# EAGLE design ME433-2021 (EAGLE 9.6.2)
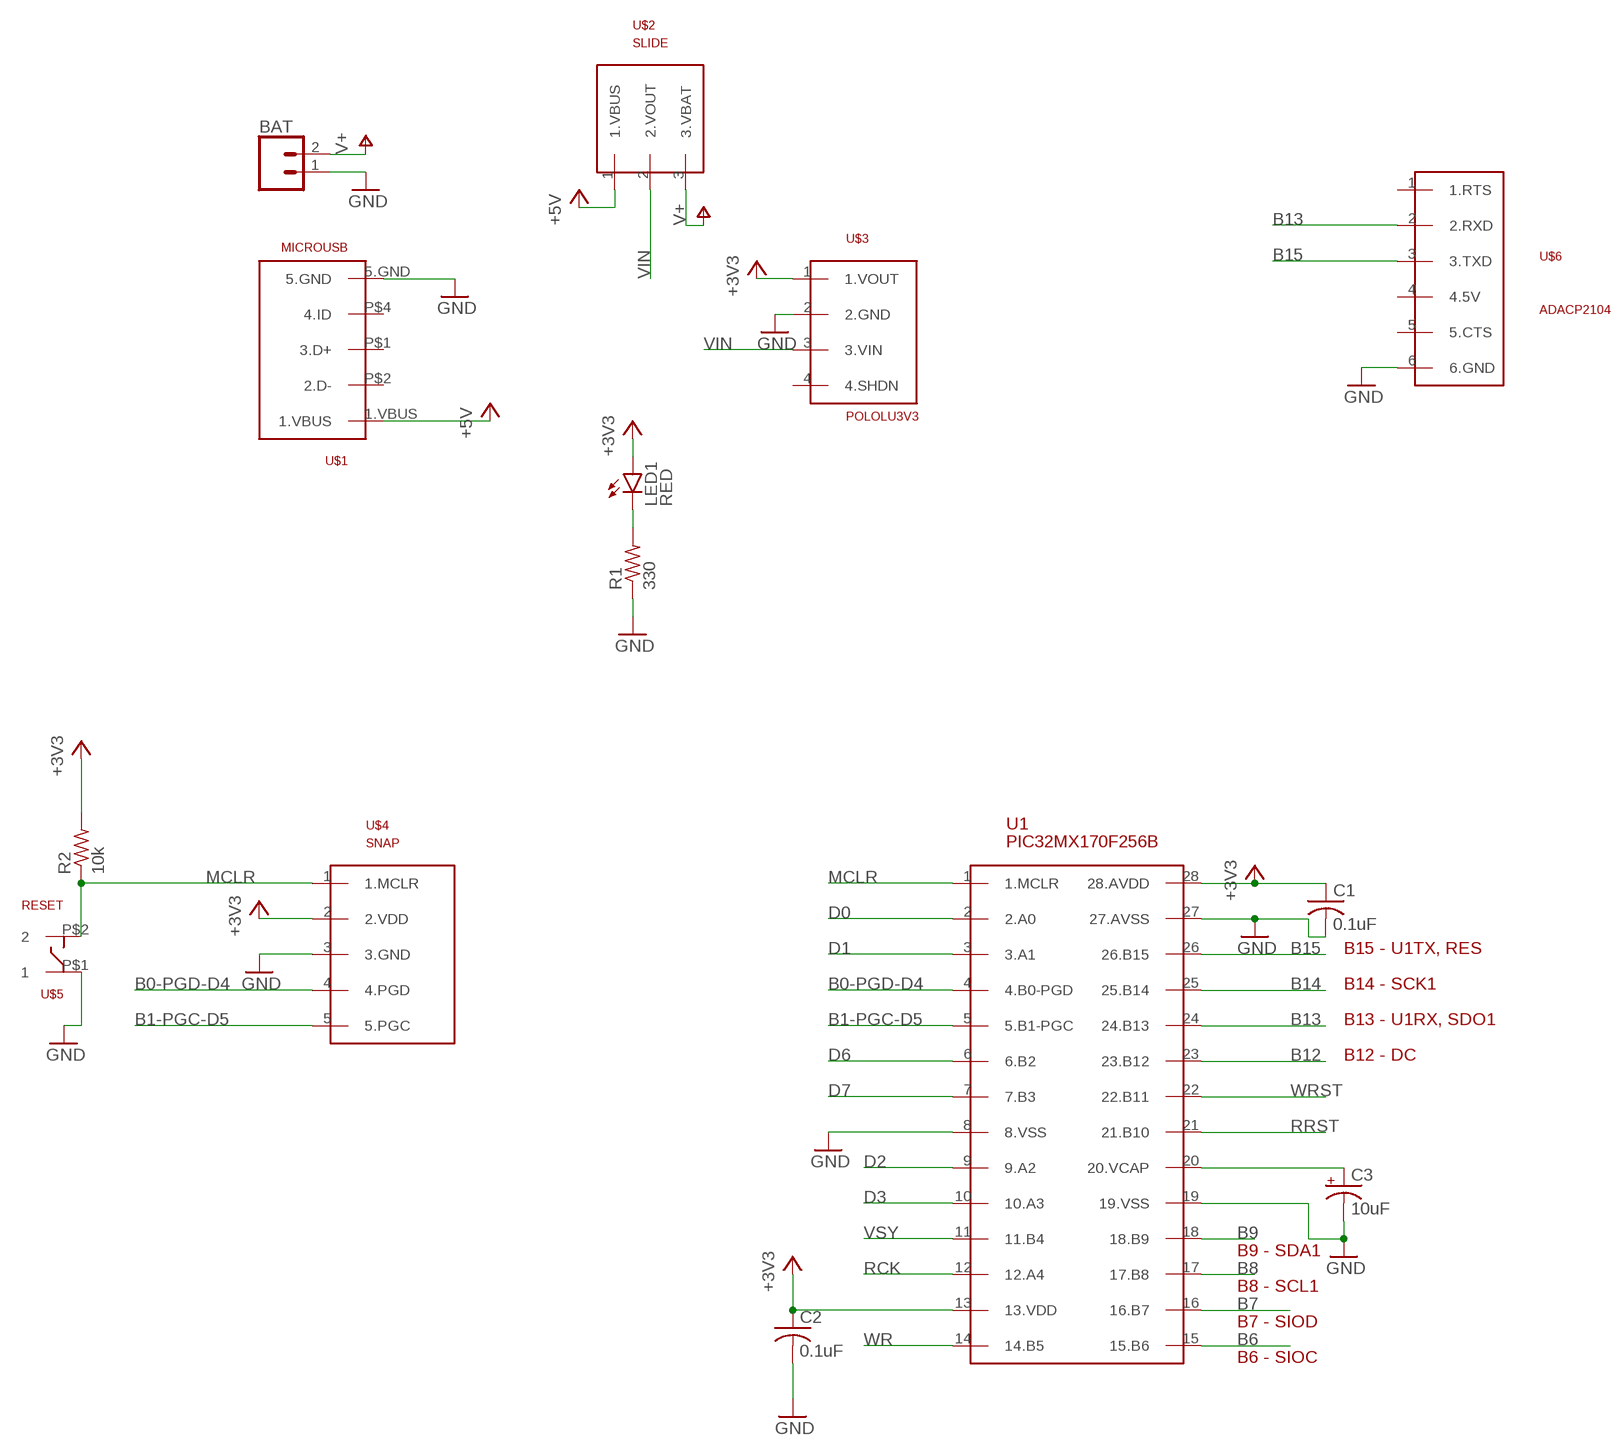
[diagram p0: schematic, sheet 1, part 1 of 2]
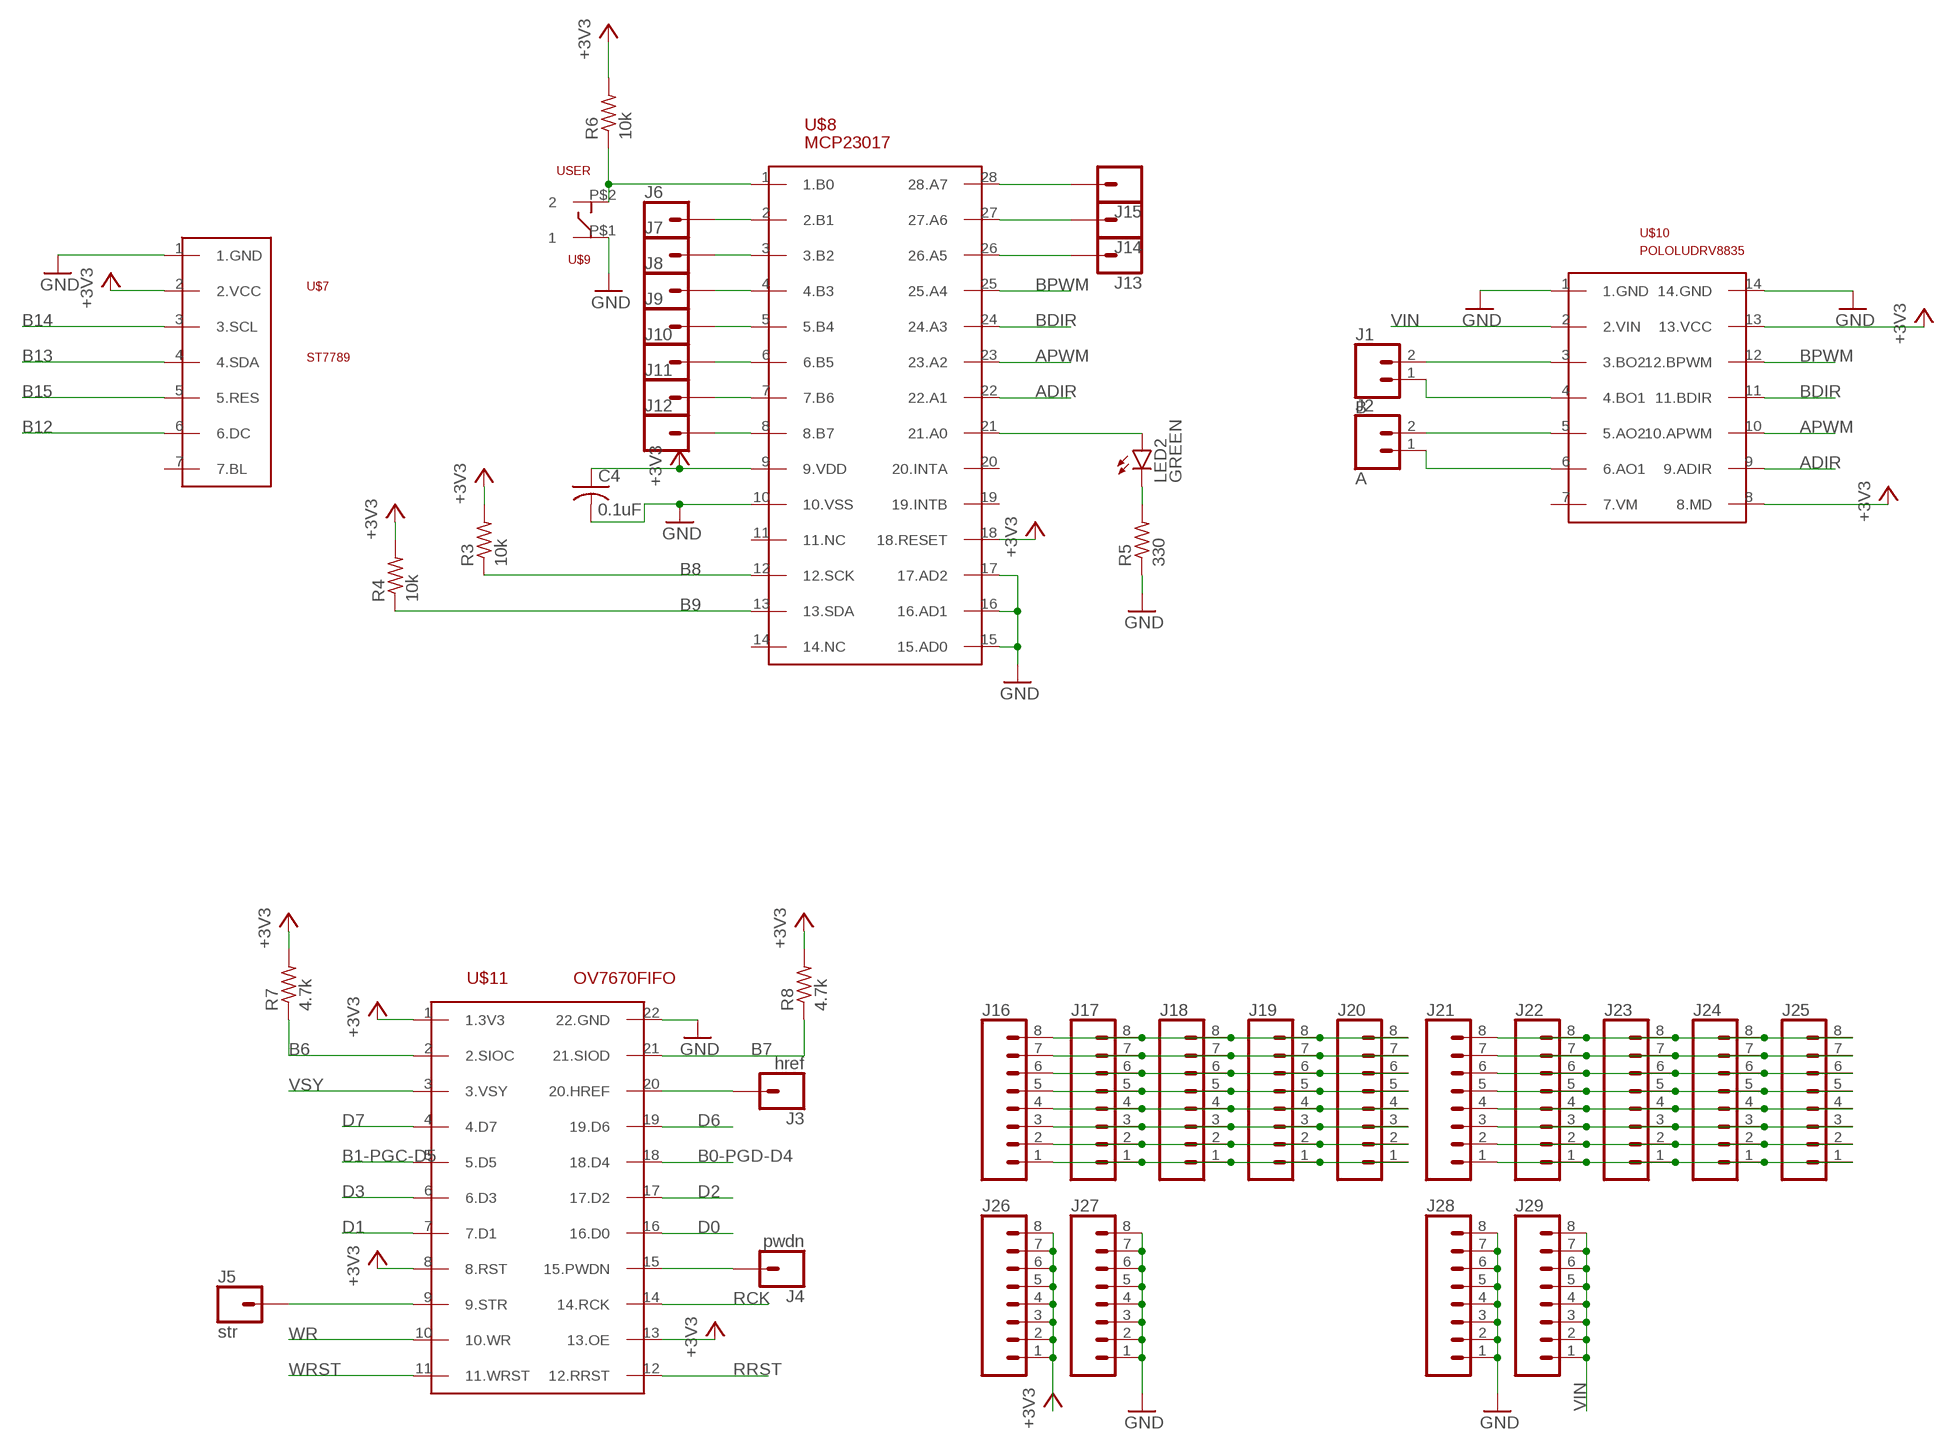
[diagram p1: schematic, sheet 1, part 2 of 2]

## Parts
BAT  CONN_02  [1X02]
C1  0.1uF  C-US025-030X050  [C025-030X050]
C2  0.1uF  C-US025-030X050  [C025-030X050]
C3  10uF  CPOL-USB45181B  [B45181B]
C4  0.1uF  C-US025-030X050  [C025-030X050]
J1  B  CONN_02  [1X02]
J2  A  CONN_02  [1X02]
J3  href  CONN_01  [1X01]
J4  pwdn  CONN_01  [1X01]
J5  str  CONN_01  [1X01]
J6  CONN_01  [1X01]
J7  CONN_01  [1X01]
J8  CONN_01  [1X01]
J9  CONN_01  [1X01]
J10  CONN_01  [1X01]
J11  CONN_01  [1X01]
J12  CONN_01  [1X01]
J13  CONN_01  [1X01]
J14  CONN_01  [1X01]
J15  CONN_01  [1X01]
J16  CONN_08"  [1X08]
J17  CONN_08"  [1X08]
J18  CONN_08"  [1X08]
J19  CONN_08"  [1X08]
J20  CONN_08"  [1X08]
J21  CONN_08"  [1X08]
J22  CONN_08"  [1X08]
J23  CONN_08"  [1X08]
J24  CONN_08"  [1X08]
J25  CONN_08"  [1X08]
J26  CONN_08"  [1X08]
J27  CONN_08"  [1X08]
J28  CONN_08"  [1X08]
J29  CONN_08"  [1X08]
LED1  RED  LED3MM  [LED3MM]
LED2  GREEN  LED3MM  [LED3MM]
R1  330  R-US_0207/10  [0207/10]
R2  10k  R-US_0207/10  [0207/10]
R3  10k  R-US_0207/10  [0207/10]
R4  10k  R-US_0207/10  [0207/10]
R5  330  R-US_0207/10  [0207/10]
R6  10k  R-US_0207/10  [0207/10]
R7  4.7k  R-US_0207/10  [0207/10]
R8  4.7k  R-US_0207/10  [0207/10]
U1  PIC32MX170F256B  [DIL28-3]
U$1  MICROUSB  [MICROUSB]
U$2  SLIDE  [SLIDE]
U$3  POLOLU3V3  [POLOLU3V3]
U$4  SNAP  [SNAP]
U$5  RESET  PUSH  [PUSH]
U$6  ADACP2104  [ADACP2104]
U$7  ST7789  [ST7789]
U$8  MCP23017  [DIL28-3]
U$9  USER  PUSH  [PUSH]
U$10  POLOLUDRV8835  [POLOLUDRV8835]
U$11  OV7670FIFO  [OV7670FIFO]

## Nets
+3V3: C1.1 C2.1 C4.1 J26.1 J26.2 J26.3 J26.4 J26.5 J26.6 J26.7 J26.8 LED1.A R2.2 R3.2 R4.2 R6.2 R7.2 R8.2 U1.13(13.VDD) U1.28(28.AVDD) U$3.1(1.VOUT) U$4.2(2.VDD) U$7.2(2.VCC) U$8.9(9.VDD) U$8.18(18.RESET) U$10.8(8.MD) U$10.13(13.VCC) U$11.1(1.3V3) U$11.8(8.RST) U$11.13(13.OE)
+5V: U$1.1.VBUS U$2.1(1.VBUS)
ADIR: U$8.22(22.A1) U$10.9(9.ADIR)
APWM: U$8.23(23.A2) U$10.10(10.APWM)
B0-PGD-D4: U1.4(4.B0-PGD) U$4.4(4.PGD) U$11.18(18.D4)
B1-PGC-D5: U1.5(5.B1-PGC) U$4.5(5.PGC) U$11.5(5.D5)
B6: R7.1 U1.15(15.B6) U$11.2(2.SIOC)
B7: R8.1 U1.16(16.B7) U$11.21(21.SIOD)
B8: R3.1 U1.17(17.B8) U$8.12(12.SCK)
B9: R4.1 U1.18(18.B9) U$8.13(13.SDA)
B12: U1.23(23.B12) U$7.6(6.DC)
B13: U1.24(24.B13) U$6.2(2.RXD) U$7.4(4.SDA)
B14: U1.25(25.B14) U$7.3(3.SCL)
B15: U1.26(26.B15) U$6.3(3.TXD) U$7.5(5.RES)
BDIR: U$8.24(24.A3) U$10.11(11.BDIR)
BPWM: U$8.25(25.A4) U$10.12(12.BPWM)
D0: U1.2(2.A0) U$11.16(16.D0)
D1: U1.3(3.A1) U$11.7(7.D1)
D2: U1.9(9.A2) U$11.17(17.D2)
D3: U1.10(10.A3) U$11.6(6.D3)
D6: U1.6(6.B2) U$11.19(19.D6)
D7: U1.7(7.B3) U$11.4(4.D7)
GND: BAT.1 C1.2 C2.2 C3.- C4.2 J27.1 J27.2 J27.3 J27.4 J27.5 J27.6 J27.7 J27.8 J28.1 J28.2 J28.3 J28.4 J28.5 J28.6 J28.7 J28.8 R1.1 R5.1 U1.8(8.VSS) U1.19(19.VSS) U1.27(27.AVSS) U$1.5.GND U$3.2(2.GND) U$4.3(3.GND) U$5.P$1 U$6.6(6.GND) U$7.1(1.GND) U$8.10(10.VSS) U$8.15(15.AD0) U$8.16(16.AD1) U$8.17(17.AD2) U$9.P$1 U$10.1(1.GND) U$10.14(14.GND) U$11.22(22.GND)
MCLR: R2.1 U1.1(1.MCLR) U$4.1(1.MCLR) U$5.P$2
N$1: LED1.K(C) R1.2
N$2: LED2.A U$8.21(21.A0)
N$3: C3.+ U1.20(20.VCAP)
N$4: R6.1 U$8.1(1.B0) U$9.P$2
N$5: LED2.K(C) R5.2
N$6: J1.2 U$10.3(3.BO2)
N$7: J1.1 U$10.4(4.BO1)
N$8: J2.2 U$10.5(5.AO2)
N$9: J2.1 U$10.6(6.AO1)
N$10: J3.1 U$11.20(20.HREF)
N$11: J4.1 U$11.15(15.PWDN)
N$12: J5.1 U$11.9(9.STR)
N$13: J15.1 U$8.28(28.A7)
N$14: J14.1 U$8.27(27.A6)
N$15: J13.1 U$8.26(26.A5)
N$16: J6.1 U$8.2(2.B1)
N$17: J7.1 U$8.3(3.B2)
N$18: J8.1 U$8.4(4.B3)
N$19: J9.1 U$8.5(5.B4)
N$20: J10.1 U$8.6(6.B5)
N$21: J11.1 U$8.7(7.B6)
N$22: J12.1 U$8.8(8.B7)
N$23: J16.8 J17.8 J18.8 J19.8 J20.8
N$24: J16.7 J17.7 J18.7 J19.7 J20.7
N$25: J16.6 J17.6 J18.6 J19.6 J20.6
N$26: J16.5 J17.5 J18.5 J19.5 J20.5
N$27: J16.4 J17.4 J18.4 J19.4 J20.4
N$28: J16.3 J17.3 J18.3 J19.3 J20.3
N$29: J16.2 J17.2 J18.2 J19.2 J20.2
N$30: J16.1 J17.1 J18.1 J19.1 J20.1
N$31: J21.8 J22.8 J23.8 J24.8 J25.8
N$32: J21.7 J22.7 J23.7 J24.7 J25.7
N$33: J21.6 J22.6 J23.6 J24.6 J25.6
N$34: J21.5 J22.5 J23.5 J24.5 J25.5
N$35: J21.4 J22.4 J23.4 J24.4 J25.4
N$36: J21.3 J22.3 J23.3 J24.3 J25.3
N$37: J21.2 J22.2 J23.2 J24.2 J25.2
N$38: J21.1 J22.1 J23.1 J24.1 J25.1
RCK: U1.12(12.A4) U$11.14(14.RCK)
RRST: U1.21(21.B10) U$11.12(12.RRST)
V+: BAT.2 U$2.3(3.VBAT)
VIN: J29.1 J29.2 J29.3 J29.4 J29.5 J29.6 J29.7 J29.8 U$2.2(2.VOUT) U$3.3(3.VIN) U$10.2(2.VIN)
VSY: U1.11(11.B4) U$11.3(3.VSY)
WR: U1.14(14.B5) U$11.10(10.WR)
WRST: U1.22(22.B11) U$11.11(11.WRST)
Unconnected: U$1.P$1(3.D+) U$1.P$2(2.D-) U$1.P$4(4.ID) U$3.4(4.SHDN) U$6.1(1.RTS) U$6.4(4.5V) U$6.5(5.CTS) U$7.7(7.BL) U$8.11(11.NC) U$8.14(14.NC) U$8.19(19.INTB) U$8.20(20.INTA) U$10.7(7.VM)

## Notes on the sheet
- B15 - U1TX, RES
- B14 - SCK1
- B13 - U1RX, SDO1
- B12 - DC
- B9 - SDA1
- B8 - SCL1
- B7 - SIOD
- B6 - SIOC

## Library data of the parts
BAT J1 J2 = me433-2021:CONN_02: Multi connection point. Often used as Generic Header-pin footprint for 0.1 inch spaced/style header connections On any of the 0.1 inch spaced packages, you can populate with these: Break Away Headers - Straight <https://www.sparkfun.com/products/116> (PRT-00116) Break Away Male Headers - Right Angle <https://www.sparkfun.com/products/553> (PRT-00553) Female Headers <https://www.sparkfun.com/products/115> (PRT-00115) Break Away Headers - Machine Pin <https://www.sparkfun.com/products/117> (PRT-00117) Break Away Female Headers - Swiss Machine Pin <https://www.sparkfun.com/products/743> (PRT-00743) For SCREWTERMINALS and SPRING TERMINALS visit here: Screw Terimnals on SparkFun.com <https://www.sparkfun.com/search/results?term=Screw+Terminals> (5mm/3.5mm/2.54mm spacing) This device is also useful as a general connection point to wire up your design to another part of your project. Our various solder wires solder well into these plated through hole pads. Hook-Up Wire - Assortment (Stranded, 22 AWG) <https://www.sparkfun.com/products/11375> (PRT-11375) Hook-Up Wire - Assortment (Solid Core, 22 AWG) <https://www.sparkfun.com/products/11367> (PRT-11367) View the entire wire category on our website here <https://www.sparkfun.com/categories/141> Special notes: Molex polarized connector foot print use with: PRT-08233 with associated crimp pins and housings. 2.54_SCREWTERM for use with PRT-10571. 3.5mm Screw Terminal footprints for PRT-08084 5mm Screw Terminal footprints for use with PRT-08432
C1 C2 C4 = me433-2021:C-US: CAPACITOR, American symbol; SPICEPREFIX: C
C3 = me433-2021:CPOL-US: POLARIZED CAPACITOR, American symbol; SPICEPREFIX: C
J3-J15 = me433-2021:CONN_01: Single connection point. Often used as Generic Header-pin footprint for 0.1 inch spaced/style header connections On any of the 0.1 inch spaced packages, you can populate with these: Break Away Headers - Straight <https://www.sparkfun.com/products/116> (PRT-00116) Break Away Male Headers - Right Angle <https://www.sparkfun.com/products/553> (PRT-00553) Female Headers <https://www.sparkfun.com/products/115> (PRT-00115) Break Away Headers - Machine Pin <https://www.sparkfun.com/products/117> (PRT-00117) Break Away Female Headers - Swiss Machine Pin <https://www.sparkfun.com/products/743> (PRT-00743) This device is also useful as a general connection point to wire up your design to another part of your project. Our various solder wires solder well into these plated through hole pads. Hook-Up Wire - Assortment (Stranded, 22 AWG) <https://www.sparkfun.com/products/11375> (PRT-11375) Hook-Up Wire - Assortment (Solid Core, 22 AWG) <https://www.sparkfun.com/products/11367> (PRT-11367) View the entire wire category on our website here <https://www.sparkfun.com/categories/141> Special notes: SMTSO-256-ET is a "flush mount" nut for a 4-40 screw. We mostly use this on specialty testbeds; it is a nice way to connect hardware to your PCB at an adjustable hieght. Also note, the SNAP packages are for using a snappable style connector. We sell a baggie of snaps and they are also used on two LilyPad designs: Snap Assortment - 30 pack (male and female) <https://www.sparkfun.com/products/11347> (DEV-11347) LilyPad Arduino SimpleSnap <https://www.sparkfun.com/products/10941> (DEV-10941) LilyPad SimpleSnap Protoboard <https://www.sparkfun.com/products/10940> (DEV-10940)
J16-J29 = me433-2021:CONN_08: Multi connection point. Often used as Generic Header-pin footprint for 0.1 inch spaced/style header connections On any of the 0.1 inch spaced packages, you can populate with these: Break Away Headers - Straight <https://www.sparkfun.com/products/116> (PRT-00116) Break Away Male Headers - Right Angle <https://www.sparkfun.com/products/553> (PRT-00553) Female Headers <https://www.sparkfun.com/products/115> (PRT-00115) Break Away Headers - Machine Pin <https://www.sparkfun.com/products/117> (PRT-00117) Break Away Female Headers - Swiss Machine Pin <https://www.sparkfun.com/products/743> (PRT-00743) Arduino Stackable Header - 8 Pin <https://www.sparkfun.com/products/9279> (PRT-09279) For SCREWTERMINALS and SPRING TERMINALS visit here: Screw Terimnals on SparkFun.com <https://www.sparkfun.com/search/results?term=Screw+Terminals> (5mm/3.5mm/2.54mm spacing) This device is also useful as a general connection point to wire up your design to another part of your project. Our various solder wires solder well into these plated through hole pads. Hook-Up Wire - Assortment (Stranded, 22 AWG) <https://www.sparkfun.com/products/11375> (PRT-11375) Hook-Up Wire - Assortment (Solid Core, 22 AWG) <https://www.sparkfun.com/products/11367> (PRT-11367) View the entire wire category on our website here <https://www.sparkfun.com/categories/141> Special notes: Molex polarized connector foot print use with SKU : PRT-08231 with associated crimp pins and housings. 1MM SMD Version SKU: PRT-10208 NOTES ON THE VARIANTS LOCK and LOCK_LONGPADS... This footprint was designed to help hold the alignment of a through-hole component (i.e. 6-pin header) while soldering it into place. You may notice that each hole has been shifted either up or down by 0.005 of an inch from it's more standard position (which is a perfectly straight line). This slight alteration caused the pins (the squares in the middle) to touch the edges of the holes. Because they are alternating, it causes a "brace" to hold the component in place. 0.005 has proven to be the perfect amount of "off-center" position when using our standard breakaway headers. Although looks a little odd when you look at the bare footprint, once you have a header in there, the alteration is very hard to notice. Also,if you push a header all the way into place, it is covered up entirely on the bottom side.; PROD_ID: CONN-08438
LED1 LED2 = me433-2021:LED: LED OSRAM: - CHIPLED LG R971, LG N971, LY N971, LG Q971, LY Q971, LO R971, LY R971 LH N974, LH R974 LS Q976, LO Q976, LY Q976 LO Q996 - Hyper CHIPLED LW Q18S LB Q993, LB Q99A, LB R99A - SideLED LS A670, LO A670, LY A670, LG A670, LP A670 LB A673, LV A673, LT A673, LW A673 LH A674 LY A675 LS A676, LA A676, LO A676, LY A676, LW A676 LS A679, LY A679, LG A679 - Hyper Micro SIDELED® LS Y876, LA Y876, LO Y876, LY Y876 LT Y87S - SmartLED LW L88C, LW L88S LB L89C, LB L89S, LG L890 LS L89K, LO L89K, LY L89K LS L896, LA L896, LO L896, LY L896 - TOPLED LS T670, LO T670, LY T670, LG T670, LP T670 LSG T670, LSP T670, LSY T670, LOP T670, LYG T670 LG T671, LOG T671, LSG T671 LB T673, LV T673, LT T673, LW T673 LH T674 LS T676, LA T676, LO T676, LY T676, LB T676, LH T676, LSB T676, LW T676 LB T67C, LV T67C, LT T67C, LS T67K, LO T67K, LY T67K, LW E67C LS E67B, LA E67B, LO E67B, LY E67B, LB E67C, LV E67C, LT E67C LW T67C LS T679, LY T679, LG T679 LS T770, LO T770, LY T770, LG T770, LP T770 LB T773, LV T773, LT T773, LW T773 LH T774 LS E675, LA E675, LY E675, LS T675 LS T776, LA T776, LO T776, LY T776, LB T776 LHGB T686 LT T68C, LB T68C - Hyper Mini TOPLED® LB M676 - Mini TOPLED Santana® LG M470 LS M47K, LO M47K, LY M47K Source: http://www.osram.convergy.de LUXEON: - LUMILED® LXK2-PW12-R00, LXK2-PW12-S00, LXK2-PW14-U00, LXK2-PW14-V00 LXK2-PM12-R00, LXK2-PM12-S00, LXK2-PM14-U00 LXK2-PE12-Q00, LXK2-PE12-R00, LXK2-PE12-S00, LXK2-PE14-T00, LXK2-PE14-U00 LXK2-PB12-K00, LXK2-PB12-L00, LXK2-PB12-M00, LXK2-PB14-N00, LXK2-PB14-P00, LXK2-PB14-Q00 LXK2-PR12-L00, LXK2-PR12-M00, LXK2-PR14-Q00, LXK2-PR14-R00 LXK2-PD12-Q00, LXK2-PD12-R00, LXK2-PD12-S00 LXK2-PH12-R00, LXK2-PH12-S00 LXK2-PL12-P00, LXK2-PL12-Q00, LXK2-PL12-R00 Source: www.luxeon.com KINGBRIGHT: KA-3528ASYC Source: www.kingbright.com
R1-R8 = me433-2021:R-US_: RESISTOR, American symbol; SPICEPREFIX: R
U1 = me433-2021:PIC32MX170F256B
U$1 = me433-2021:MICROUSB
U$2 = me433-2021:SLIDE
U$3 = me433-2021:POLOLU3V3
U$4 = me433-2021:SNAP
U$5 U$9 = me433-2021:PUSH
U$6 = me433-2021:ADACP2104
U$7 = me433-2021:ST7789
U$8 = me433-2021:MCP23017
U$10 = me433-2021:POLOLUDRV8835
U$11 = me433-2021:OV7670FIFO

## Board
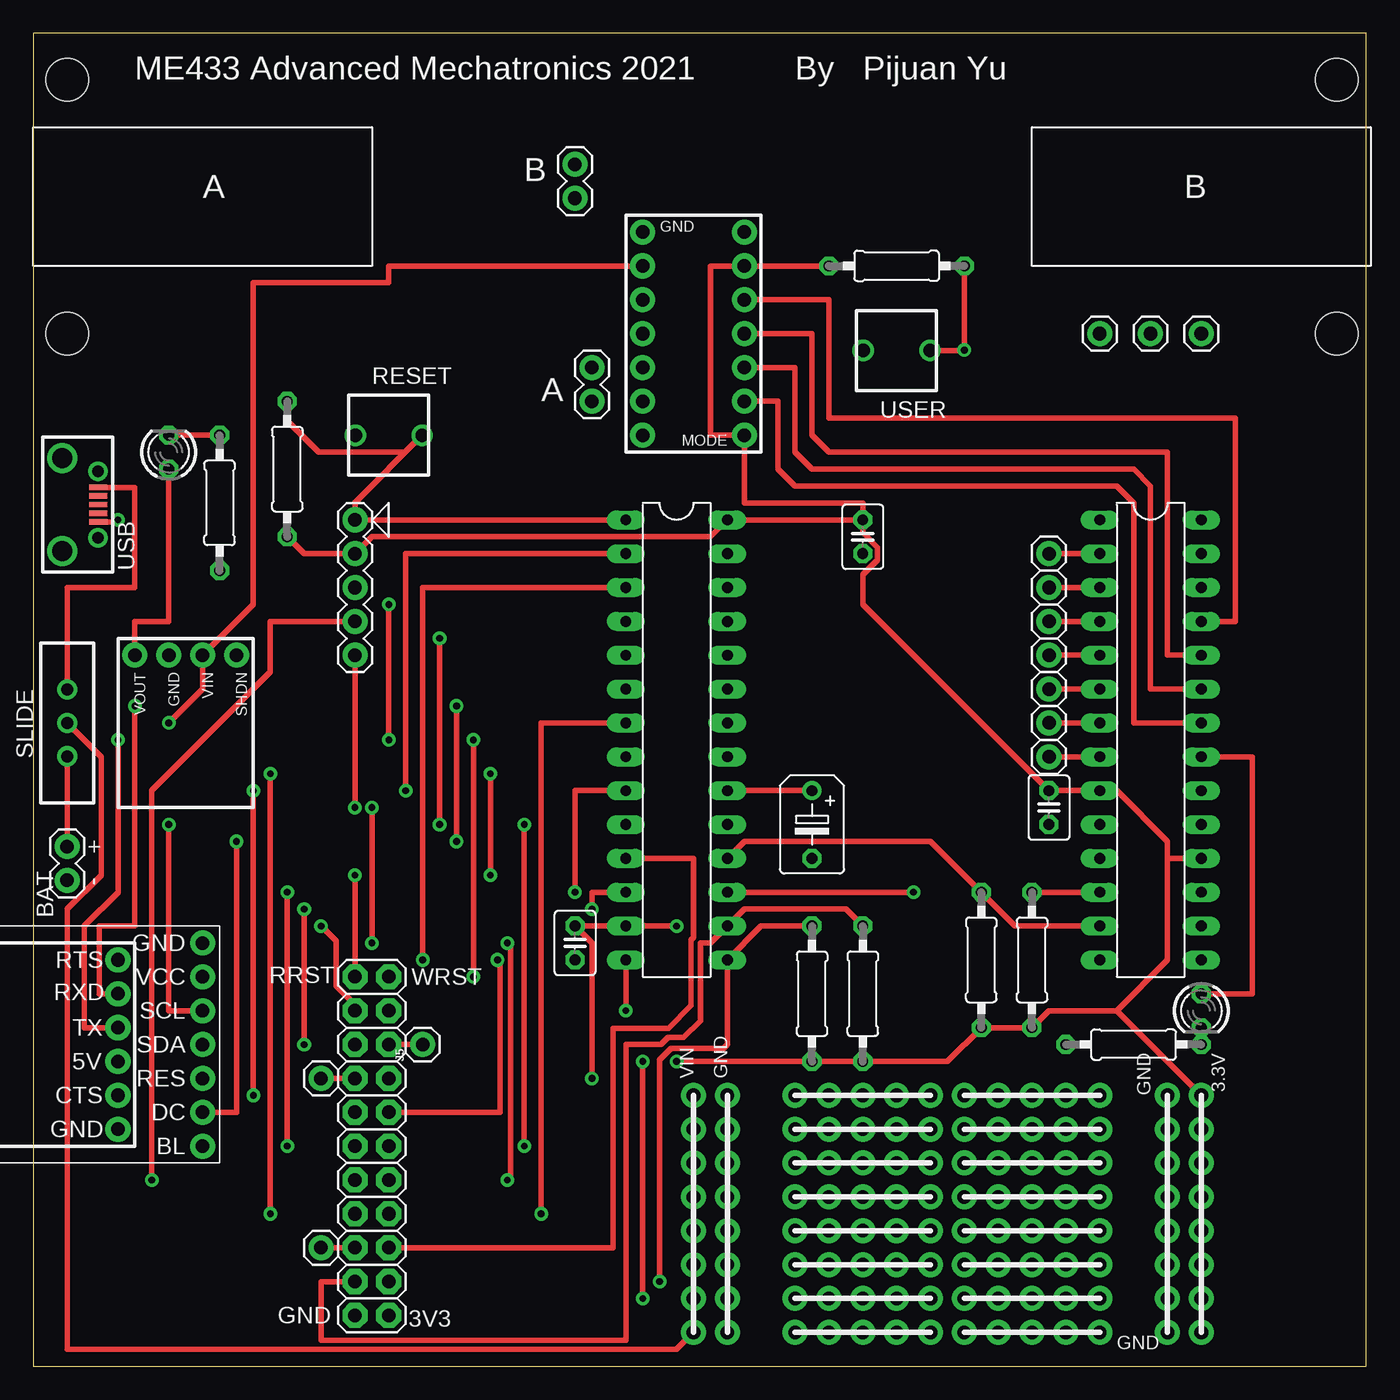
[diagram p2: board, top side]
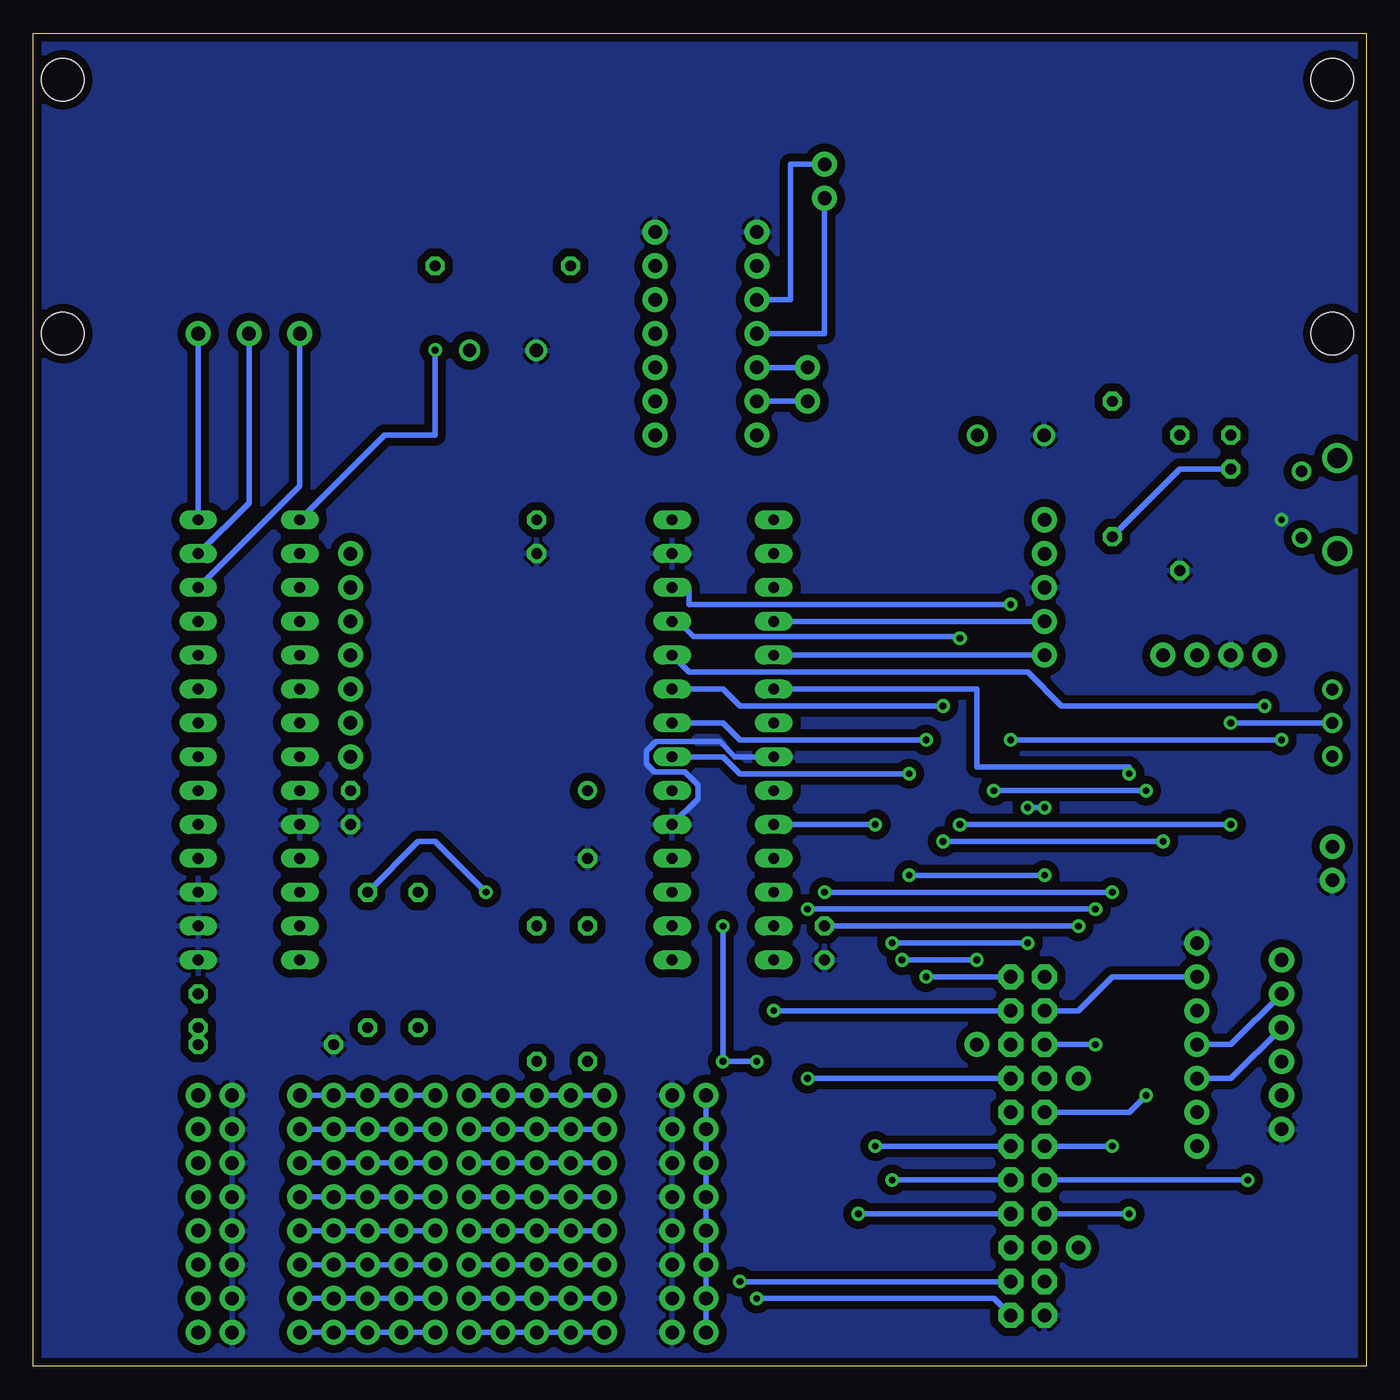
[diagram p3: board, bottom side, seen from below]

Size 100 x 100 mm. Coordinates in mm from the lower left corner, seen from the top.
Outline: 0,0 100,0 100,100 0,100 0,0
Copper layers (1*16): Top 0.035mm / dielectric 1.5mm / Bottom 0.035mm
Design rules "SparkFun": minimum track width 8mil, minimum drill 20mil, track to track 8mil, track to pad 8mil, pad to pad 8mil, via to via 8mil, smd to smd 8mil, copper to edge 8mil, drill to drill 8mil, minimum pad ring 12mil, minimum via ring 10mil, stop-mask expansion 4mil, vias tented up to drill 20mil, thermal gap 10mil
Holes 3.17 mm at 2.54,96.52 2.54,77.47 97.79,96.52 97.79,77.47

### Footprints (pad centres in the part's own frame; a part is rotated, then mirrored left to right if it is on the bottom)
1X02 = drill 1.016 pad 1.88: 1 0,0; 2 2.54,0
C025-030X050 = drill 0.813 octagon: 1 -1.27,0; 2 1.27,0
B45181B = drill 0.813: + -2.54,0 | drill 0.813 octagon: - 2.54,0
1X01 = drill 1.016 pad 1.88: 1 0,0
1X08 = drill 1.016 pad 1.88: 1 0,0; 2 2.54,0; 3 5.08,0; 4 7.62,0; 5 10.16,0; 6 12.7,0; 7 15.24,0; 8 17.78,0
LED3MM = drill 0.813 octagon: A -1.27,0; K 1.27,0
0207/10 = drill 0.813 octagon: 1 -5.08,0; 2 5.08,0
DIL28-3 = drill 0.813 long: 1 -16.51,-3.81; 2 -13.97,-3.81; 3 -11.43,-3.81; 4 -8.89,-3.81; 5 -6.35,-3.81; 6 -3.81,-3.81; 7 -1.27,-3.81; 8 1.27,-3.81; 9 3.81,-3.81; 10 6.35,-3.81; 11 8.89,-3.81; 12 11.43,-3.81; 13 13.97,-3.81; 14 16.51,-3.81; 15 16.51,3.81; 16 13.97,3.81; 17 11.43,3.81; 18 8.89,3.81; 19 6.35,3.81; 20 3.81,3.81; 21 1.27,3.81; 22 -1.27,3.81; 23 -3.81,3.81; 24 -6.35,3.81; 25 -8.89,3.81; 26 -11.43,3.81; 27 -13.97,3.81; 28 -16.51,3.81
MICROUSB = smd 0.4 x 1.35: 1.VBUS -1.3,2.7; 5.GND 1.3,2.7; P$1 0,2.7; P$2 0.65,2.7; P$4 -0.65,2.7 | drill 0.85: P$6 -2.5,2.7; P$7 2.5,2.7 | drill 1.5: P$8 -3.5,0; P$9 3.5,0
SLIDE = drill 0.9: 1 -2.5,0; 2 0,0; 3 2.5,0
POLOLU3V3 = drill 1.016 pad 1.88: 1 0,3.81; 2 0,1.27; 3 0,-1.27; 4 0,-3.81
SNAP = drill 1.016 pad 1.88: 1 0,5.08; 2 0,2.54; 3 0,0; 4 0,-2.54; 5 0,-5.08
PUSH = drill 1: P$1 -2.5,0; P$2 2.5,0
ADACP2104 = drill 1.016 pad 1.88: 1 3.81,7.62; 2 3.81,5.08; 3 3.81,2.54; 4 3.81,0; 5 3.81,-2.54; 6 3.81,-5.08
ST7789 = drill 1.016 pad 1.88: 1 5.08,6.35; 2 5.08,3.81; 3 5.08,1.27; 4 5.08,-1.27; 5 5.08,-3.81; 6 5.08,-6.35; 7 5.08,-8.89
POLOLUDRV8835 = drill 1.016 pad 1.88: 1 -2.54,3.81; 2 -2.54,1.27; 3 -2.54,-1.27; 4 -2.54,-3.81; 5 -2.54,-6.35; 6 -2.54,-8.89; 7 -2.54,-11.43; 8 5.08,-11.43; 9 5.08,-8.89; 10 5.08,-6.35; 11 5.08,-3.81; 12 5.08,-1.27; 13 5.08,1.27; 14 5.08,3.81
OV7670FIFO = drill 1.016 pad 1.88 octagon: 1 -11.43,-2.54; 2 -8.89,-2.54; 3 -6.35,-2.54; 4 -3.81,-2.54; 5 -1.27,-2.54; 6 1.27,-2.54; 7 3.81,-2.54; 8 6.35,-2.54; 9 8.89,-2.54; 10 11.43,-2.54; 11 13.97,-2.54; 12 13.97,0; 13 11.43,0; 14 8.89,0; 15 6.35,0; 16 3.81,0; 17 1.27,0; 18 -1.27,0; 19 -3.81,0; 20 -6.35,0; 21 -8.89,0; 22 -11.43,0

### Placement (x,y rotation side)
BAT  2.54,36.45 90 top
C1  62.23,62.23 270 top
C2  40.64,31.75 270 top
C3  58.42,40.64 270 top
C4  76.2,41.91 270 top
J1  40.64,87.63 90 top
J2  41.91,72.39 90 top
J3  21.59,8.89 90 top
J4  21.59,21.59 90 top
J5  29.21,24.13 90 top
J6  76.2,60.96 90 top
J7  76.2,58.42 90 top
J8  76.2,55.88 90 top
J9  76.2,53.34 90 top
J10  76.2,50.8 90 top
J11  76.2,48.26 90 top
J12  76.2,45.72 90 top
J13  80.01,77.47 90 top
J14  83.82,77.47 90 top
J15  87.63,77.47 90 top
J16  57.15,2.54 90 top
J17  59.69,2.54 90 top
J18  62.23,2.54 90 top
J19  64.77,2.54 90 top
J20  67.31,2.54 90 top
J21  69.85,2.54 90 top
J22  72.39,2.54 90 top
J23  74.93,2.54 90 top
J24  77.47,2.54 90 top
J25  80.01,2.54 90 top
J26  87.63,2.54 90 top
J27  52.07,2.54 90 top
J28  85.09,2.54 90 top
J29  49.53,2.54 90 top
LED1  10.16,68.58 90 top
LED2  87.63,26.67 270 top
R1  13.97,64.77 90 top
R2  19.05,67.31 270 top
R3  74.93,30.48 270 top
R4  71.12,30.48 270 top
R5  82.55,24.13 0 top
R6  64.77,82.55 180 top
R7  58.42,27.94 270 top
R8  62.23,27.94 270 top
U1  48.26,46.99 270 top
U$1  2.16,64.64 270 top
U$2  2.54,48.26 270 top
U$3  11.43,53.34 90 top
U$4  24.13,58.42 0 top
U$5  26.67,69.85 0 top
U$6  2.54,22.86 0 top
U$7  7.62,25.4 0 top
U$8  83.82,46.99 270 top
U$9  64.77,76.2 0 top
U$10  48.26,81.28 0 top
U$11  24.13,15.24 90 top

### Tracks (layer width: path | path; a pad name or v marks a point on that pad's centre or on a via)
+3V3  (via drill 0.51)
  Top 0.406: R6.2 U$10.13 50.8,82.55 50.8,69.85 U$10.8 53.34,64.77 62.23,64.77 C1.1 | J26.1 J26.2 J26.3 J26.4 J26.5 J26.6 J26.7 J26.8 81.28,26.67 | v48.26,22.86 R7.2 R8.2 68.58,22.86 R4.2 R3.2 76.2,26.67 81.28,26.67 | 85.09,38.1 85.09,39.37 81.28,43.18 U$8.9 C4.1 62.23,57.15 62.23,59.38 63.35,60.5 63.35,61.42 62.23,62.54 C1.1 | U$8.18 85.09,38.1 | R2.2 20.32,60.96 U$4.2 25.4,62.23 50.8,62.23 U1.28 C1.1 | U$3.1 7.62,55.88 10.16,55.88 LED1.A | 85.09,38.1 85.09,30.48 81.28,26.67 | v45.72,22.86 v45.72,5.08 | U$11.13 24.13,27.12 22.71,28.55 22.71,31.9 v21.59,33.02 | v41.91,21.59 41.91,31.75 C2.1 U1.13 v48.26,33.02
  Bottom 0.406: U$7.2 19.05,29.21 21.59,26.67 U$11.13 | LED1.A 13.97,67.31 R2.2 | U$11.1 27.94,5.08 v45.72,5.08 | v48.26,33.02 v48.26,22.86 v45.72,22.86 | C2.1 v21.59,33.02 | v41.91,21.59 U$11.8
+5V
  Top 0.406: U$1.1.VBUS 4.89,65.91 7.62,65.91 7.62,58.42 2.54,58.42 U$2.1
ADIR
  Top 0.406: U$8.22 82.55,48.26 82.55,64.77 81.28,66.04 57.15,66.04 55.88,67.31 55.88,72.39 U$10.9
APWM
  Top 0.406: U$8.23 83.82,50.8 83.82,66.04 82.55,67.31 58.42,67.31 57.15,68.58 57.15,74.93 U$10.10
B0-PGD-D4  (via drill 0.51)
  Top 0.406: U$4.4 17.78,55.88 17.78,52.07 8.89,43.18 v8.89,13.97
  Bottom 0.406: U1.4 U$4.4 | v8.89,13.97 U$11.18
B1-PGC-D5  (via drill 0.51)
  Top 0.406: v35.56,13.97 35.81,14.22 35.81,31.62 35.69,31.75 v35.56,31.75 | v25.4,31.75 v25.4,41.91 | U$4.5 v24.13,41.91
  Bottom 0.406: U1.5 U$4.5 | U$11.5 v35.56,13.97 | v35.56,31.75 v25.4,31.75 | v24.13,41.91 v25.4,41.91
B6  (via drill 0.51)
  Top 0.406: R7.1 54.61,33.02 U1.15 52.07,24.13 51.79,23.85 47.85,23.85 46.99,22.99 v46.99,6.35
  Bottom 0.406: v46.99,6.35 U$11.2
B7
  Top 0.406: R8.1 60.96,34.29 53.34,34.29 U1.16 50.8,31.75 50.04,31.75 50.04,25.91 48.79,24.66 47.62,24.66 47.09,24.13 44.45,24.13 44.45,1.96 21.59,1.96 21.59,6.35 U$11.21
B8  (via drill 0.51)
  Top 0.406: U$8.12 R3.1 | U1.17 v66.04,35.56
  Bottom 0.406: v66.04,35.56 69.85,39.37 71.12,39.37 R3.1
B9
  Top 0.406: U$8.13 73.66,33.02 R4.1 67.31,39.37 53.34,39.37 U1.18
B12  (via drill 0.51)
  Top 0.406: v31.75,49.53 v31.75,39.37 | v15.24,39.37 15.24,19.05 U$7.6
  Bottom 0.406: U1.23 48.26,50.8 46.99,49.53 v31.75,49.53 | v31.75,39.37 v15.24,39.37
B13  (via drill 0.51)
  Top 0.406: v7.62,49.53 7.62,33.02 4.95,33.02 4.95,27.94 U$6.2
  Bottom 0.406: U$7.4 10.16,24.13 U$6.2 | U1.24 50.8,52.07 25.4,52.07 22.86,49.53 v7.62,49.53
B14  (via drill 0.51)
  Top 0.406: v30.48,54.61 v30.48,40.64 | v10.16,40.64 10.16,26.67 U$7.3
  Bottom 0.406: U1.25 51.63,55.88 50.48,54.74 30.61,54.74 v30.48,54.61 | v30.48,40.64 v10.16,40.64
B15  (via drill 0.51)
  Top 0.406: v26.67,57.15 v26.67,46.99 | v6.35,46.99 6.35,35.56 3.81,33.02 3.81,25.4 U$6.3
  Bottom 0.406: U1.26 50.8,58.42 50.8,57.15 v26.67,57.15 | v26.67,46.99 v6.35,46.99 | U$7.5 10.16,21.59 U$6.3
BDIR
  Top 0.406: U$8.24 85.09,53.34 85.09,68.58 59.69,68.58 58.42,69.85 58.42,77.47 U$10.11
BPWM
  Top 0.406: U$10.12 59.69,80.01 59.69,71.12 90.17,71.12 90.17,55.88 U$8.25
D0  (via drill 0.51)
  Top 0.406: U1.2 27.94,60.96 v27.94,43.18 | v16.51,43.18 v16.51,20.32
  Bottom 0.406: v27.94,43.18 v16.51,43.18 | U$11.16 17.78,19.05 v16.51,20.32
D1  (via drill 0.51)
  Top 0.406: U1.3 29.21,58.42 v29.21,30.48 | U$11.7 35,19.05 35,30.48 v34.83,30.48
  Bottom 0.406: v34.83,30.48 v29.21,30.48
D2  (via drill 0.51)
  Top 0.406: v40.64,35.56 40.64,43.18 U1.9 | v19.05,16.51 v19.05,35.56
  Bottom 0.406: U$11.17 v19.05,16.51 | v19.05,35.56 v40.64,35.56
D3  (via drill 0.51)
  Top 0.406: v36.83,40.64 v36.83,16.51
  Bottom 0.406: U1.10 v36.83,40.64 | v36.83,16.51 U$11.6
D6  (via drill 0.51)
  Top 0.406: v17.78,44.45 v17.78,11.43
  Bottom 0.406: U1.6 29.21,50.8 29.21,44.96 17.78,44.96 v17.78,44.45 | v17.78,11.43 U$11.19
D7  (via drill 0.51)
  Top 0.406: U1.7 38.1,48.26 v38.1,11.43
  Bottom 0.406: U$11.4 v38.1,11.43
GND  (via drill 0.51)
  Top 0.406: U$1.5.GND 6.19,63.34 v6.35,63.5
  Bottom 0.406: U1.8 47.34,45.72 48.49,46.86 53.28,46.86 54,46.14 54,45.17 53.41,44.58 51.12,44.58 50.14,43.6 50.14,42.57 U1.19
  pour Bottom (isolate 0.61): 0,0 100.33,0 100.33,100.33 0,100.33
MCLR
  Top 0.406: U1.1 U$4.1 24.13,64.81 U$5.P$2 27.9,68.58 21.42,68.58 19.05,70.95 R2.1
N$1
  Top 0.406: R1.2 LED1.K
N$2
  Top 0.406: U$8.21 91.44,45.72 91.44,27.94 LED2.A
N$3
  Top 0.406: C3.+ U1.20
N$4  (via drill 0.51)
  Top 0.406: R6.1 v69.85,76.24 69.85,76.2 U$9.P$2
  Bottom 0.406: U$8.1 73.66,69.85 69.85,69.85 v69.85,76.24
N$5
  Top 0.406: R5.2 LED2.K
N$6
  Bottom 0.406: U$10.3 43.18,80.01 43.18,90.17 J1.2
N$7
  Bottom 0.406: U$10.4 40.64,77.47 J1.1
N$8
  Bottom 0.406: U$10.5 J2.2
N$9
  Bottom 0.406: U$10.6 J2.1
N$10
  Top 0.406: J3.1 U$11.20
N$11
  Top 0.406: J4.1 U$11.15
N$12
  Top 0.406: J5.1 U$11.9
N$13
  Bottom 0.406: U$8.28 J15.1
N$14
  Bottom 0.406: U$8.27 83.82,64.77 J14.1
N$15
  Bottom 0.406: U$8.26 80.01,66.04 J13.1
N$16
  Top 0.406: U$8.2 J6.1
N$17
  Top 0.406: U$8.3 J7.1
N$18
  Top 0.406: U$8.4 J8.1
N$19
  Top 0.406: U$8.5 J9.1
N$20
  Top 0.406: U$8.6 J10.1
N$21
  Top 0.406: U$8.7 J11.1
N$22
  Top 0.406: U$8.8 J12.1
N$23
  Bottom 0.406: J16.8 J17.8 J18.8 J19.8 J20.8
N$24
  Bottom 0.406: J16.7 J17.7 J18.7 J19.7 J20.7
N$25
  Bottom 0.406: J16.6 J17.6 J18.6 J19.6 J20.6
N$26
  Bottom 0.406: J16.5 J17.5 J18.5 J19.5 J20.5
N$27
  Bottom 0.406: J16.4 J17.4 J18.4 J19.4 J20.4
N$28
  Bottom 0.406: J16.3 J17.3 J18.3 J19.3 J20.3
N$29
  Bottom 0.406: J16.2 J17.2 J18.2 J19.2 J20.2
N$30
  Bottom 0.406: J16.1 J17.1 J18.1 J19.1 J20.1
N$31
  Bottom 0.406: J21.8 J22.8 J23.8 J24.8 J25.8
N$32
  Bottom 0.406: J21.7 J22.7 J23.7 J24.7 J25.7
N$33
  Bottom 0.406: J21.6 J22.6 J23.6 J24.6 J25.6
N$34
  Bottom 0.406: J21.5 J22.5 J23.5 J24.5 J25.5
N$35
  Bottom 0.406: J21.4 J22.4 J23.4 J24.4 J25.4
N$36
  Bottom 0.406: J21.3 J22.3 J23.3 J24.3 J25.3
N$37
  Bottom 0.406: J21.2 J22.2 J23.2 J24.2 J25.2
N$38
  Bottom 0.406: J21.1 J22.1 J23.1 J24.1 J25.1
RCK  (via drill 0.51)
  Top 0.406: v41.91,34.29 41.91,35.56 U1.12 | v20.32,24.13 v20.32,34.29
  Bottom 0.406: U$11.14 v20.32,24.13 | v20.32,34.29 v41.91,34.29
RRST  (via drill 0.51)
  Top 0.406: v34.29,44.45 v34.29,36.83 | v24.13,36.83 U$11.12
  Bottom 0.406: U1.21 48.26,45.72 46.99,44.45 v34.29,44.45 | v24.13,36.83 v34.29,36.83
V+
  Top 0.406: BAT.2 U$2.3
VIN  (via drill 0.51)
  Top 0.406: U$10.2 26.67,82.55 26.67,81.28 16.51,81.28 16.51,57.15 U$3.3 12.7,50.8 v10.16,48.26 | J29.1 48.26,1.27 2.54,1.27 2.54,34.29 5.08,36.83 5.08,45.72 U$2.2
  Bottom 0.406: J29.8 J29.7 J29.6 J29.5 J29.4 J29.3 J29.2 J29.1 | U$2.2 v10.16,48.26
VSY
  Top 0.406: U$11.3 43.51,8.89 43.51,25.35 47.65,25.35 49.35,27.05 49.35,31.98 49.53,32.16 49.53,38.1 U1.11
WR  (via drill 0.51)
  Top 0.406: U1.14 v44.45,26.67
  Bottom 0.406: v44.45,26.67 U$11.10
WRST  (via drill 0.51)
  Top 0.406: v33.02,46.99 v33.02,29.21
  Bottom 0.406: U1.22 48.26,48.26 46.99,46.99 v33.02,46.99 | v33.02,29.21 U$11.11

### Text on the board
tPlace: ME433 Advanced Mechatronics 2021 | By Pijuan Yu | B | A | B | A | USB | + | - | BAT | VIN | GND | 3.3V | GND | GND